# EAGLE schematic AllOfTheAbove (EAGLE 9.5.1)

## Sheet 1 of 3: Jacks and pots
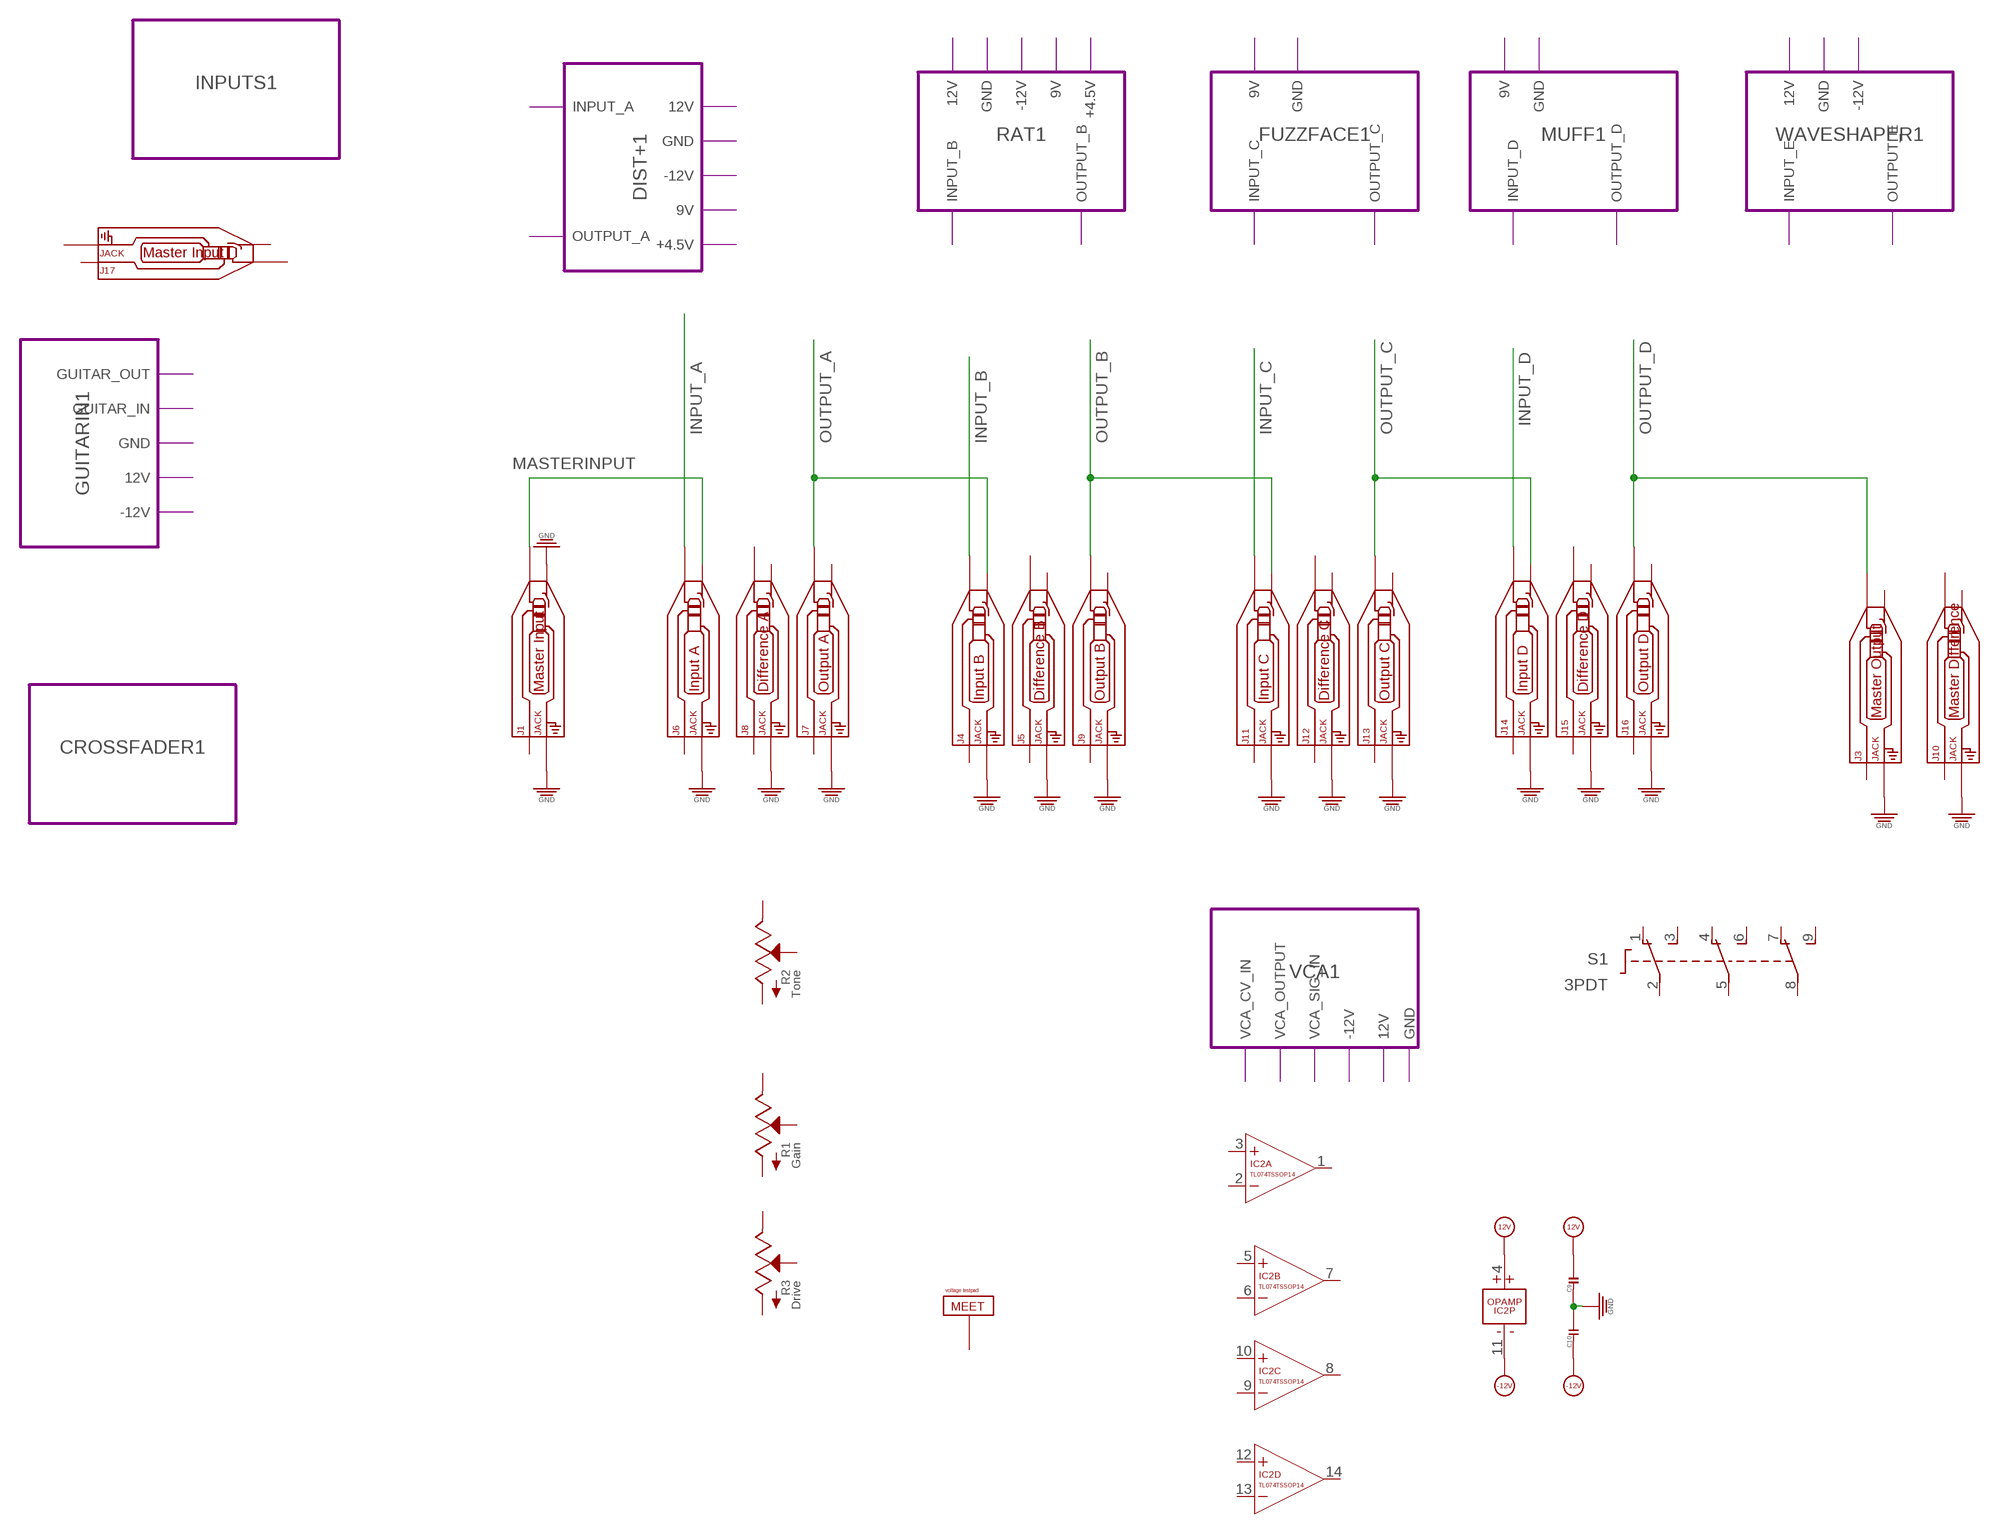
[diagram p0: schematic, sheet 1]

### Parts
C9  C-0603  [C0603]
C10  C-0603  [C0603]
IC2  TL074TSSOP14  [TSSOP14]
J1  JACK  AUDIO-JACK_SMALLSYMBOLNODRILL  [3.5MM-JACK-SWITCH-13MM-NOHOLES]
J3  JACK  AUDIO-JACK_SMALLSYMBOLNODRILL  [3.5MM-JACK-SWITCH-13MM-NOHOLES]
J4  JACK  AUDIO-JACK_SMALLSYMBOLNODRILL  [3.5MM-JACK-SWITCH-13MM-NOHOLES]
J5  JACK  AUDIO-JACK_SMALLSYMBOLNODRILL  [3.5MM-JACK-SWITCH-13MM-NOHOLES]
J6  JACK  AUDIO-JACK_SMALLSYMBOLNODRILL  [3.5MM-JACK-SWITCH-13MM-NOHOLES]
J7  JACK  AUDIO-JACK_SMALLSYMBOLNODRILL  [3.5MM-JACK-SWITCH-13MM-NOHOLES]
J8  JACK  AUDIO-JACK_SMALLSYMBOLNODRILL  [3.5MM-JACK-SWITCH-13MM-NOHOLES]
J9  JACK  AUDIO-JACK_SMALLSYMBOLNODRILL  [3.5MM-JACK-SWITCH-13MM-NOHOLES]
J10  JACK  AUDIO-JACK_SMALLSYMBOLNODRILL  [3.5MM-JACK-SWITCH-13MM-NOHOLES]
J11  JACK  AUDIO-JACK_SMALLSYMBOLNODRILL  [3.5MM-JACK-SWITCH-13MM-NOHOLES]
J12  JACK  AUDIO-JACK_SMALLSYMBOLNODRILL  [3.5MM-JACK-SWITCH-13MM-NOHOLES]
J13  JACK  AUDIO-JACK_SMALLSYMBOLNODRILL  [3.5MM-JACK-SWITCH-13MM-NOHOLES]
J14  JACK  AUDIO-JACK_SMALLSYMBOLNODRILL  [3.5MM-JACK-SWITCH-13MM-NOHOLES]
J15  JACK  AUDIO-JACK_SMALLSYMBOLNODRILL  [3.5MM-JACK-SWITCH-13MM-NOHOLES]
J16  JACK  AUDIO-JACK_SMALLSYMBOLNODRILL  [3.5MM-JACK-SWITCH-13MM-NOHOLES]
J17  JACK  AUDIO-JACK_SMALLSYMBOLNODRILL  [3.5MM-JACK-SWITCH-13MM-NOHOLES]
R1  POTSQUAREHOLE_SMALLKNOB  [ALPS_POT_SQUAREHOLES]
R2  POTSQUAREHOLE_SMALLKNOB  [ALPS_POT_SQUAREHOLES]
R3  POTSQUAREHOLE_SMALLKNOB  [ALPS_POT_SQUAREHOLES]
S1  3PDT  [3PDT]
U$13  VOLTAGETESTPAD  [POWERTESTPAD]

### Module instances
DIST+1 = DIST+
RAT1 = RAT
FUZZFACE1 = FUZZFACE
MUFF1 = MUFF
WAVESHAPER1 = WAVESHAPER
GUITARIN1 = GUITARIN
VCA1 = VCA
INPUTS1 = INPUTS
CROSSFADER1 = CROSSFADER

### Nets
12V: C9.2 IC2.4(P:V+) ; also sheet 2,3
-12V: C10.1 IC2.11(P:V-) ; also sheet 2,3
GND: C9.1 C10.2 J1.RING_B@1(RING) J1.RING_T@3(RING) J1.SWITCH_B@1(SWITCH) J1.SWITCH_T@3(SWITCH) J3.RING_B@1(RING) J3.RING_T@3(RING) J4.RING_B@1(RING) J4.RING_T@3(RING) J5.RING_B@1(RING) J5.RING_T@3(RING) J6.RING_B@1(RING) J6.RING_T@3(RING) J7.RING_B@1(RING) J7.RING_T@3(RING) J8.RING_B@1(RING) J8.RING_T@3(RING) J9.RING_B@1(RING) J9.RING_T@3(RING) J10.RING_B@1(RING) J10.RING_T@3(RING) J11.RING_B@1(RING) J11.RING_T@3(RING) J12.RING_B@1(RING) J12.RING_T@3(RING) J13.RING_B@1(RING) J13.RING_T@3(RING) J14.RING_B@1(RING) J14.RING_T@3(RING) J15.RING_B@1(RING) J15.RING_T@3(RING) J16.RING_B@1(RING) J16.RING_T@3(RING) ; also sheet 2,3
INPUT_A: J6.TIP_B@1(TIP) J6.TIP_T@3(TIP)
INPUT_B: J4.TIP_B@1(TIP) J4.TIP_T@3(TIP)
INPUT_C: J11.TIP_B@1(TIP) J11.TIP_T@3(TIP)
INPUT_D: J14.TIP_B@1(TIP) J14.TIP_T@3(TIP)
MASTERINPUT: J1.TIP_B@1(TIP) J1.TIP_T@3(TIP) J6.SWITCH_B@1(SWITCH) J6.SWITCH_T@3(SWITCH)
OUTPUT_A: J4.SWITCH_B@1(SWITCH) J4.SWITCH_T@3(SWITCH) J7.TIP_B@1(TIP) J7.TIP_T@3(TIP)
OUTPUT_B: J9.TIP_B@1(TIP) J9.TIP_T@3(TIP) J11.SWITCH_B@1(SWITCH) J11.SWITCH_T@3(SWITCH)
OUTPUT_C: J13.TIP_B@1(TIP) J13.TIP_T@3(TIP) J14.SWITCH_B@1(SWITCH) J14.SWITCH_T@3(SWITCH)
OUTPUT_D: J3.TIP_B@1(TIP) J3.TIP_T@3(TIP) J16.TIP_B@1(TIP) J16.TIP_T@3(TIP)
Unconnected: IC2.1(A:OUT) IC2.2(A:-IN) IC2.3(A:+IN) IC2.5(B:+IN) IC2.6(B:-IN) IC2.7(B:OUT) IC2.8(C:OUT) IC2.9(C:-IN) IC2.10(C:+IN) IC2.12(D:+IN) IC2.13(D:-IN) IC2.14(D:OUT) J1.SECOND_B@1(SECOND) J1.SECOND_T@3(SECOND) J3.SECOND_B@1(SECOND) J3.SECOND_T@3(SECOND) J3.SWITCH_B@1(SWITCH) J3.SWITCH_T@3(SWITCH) J4.SECOND_B@1(SECOND) J4.SECOND_T@3(SECOND) J5.SECOND_B@1(SECOND) J5.SECOND_T@3(SECOND) J5.SWITCH_B@1(SWITCH) J5.SWITCH_T@3(SWITCH) J5.TIP_B@1(TIP) J5.TIP_T@3(TIP) J6.SECOND_B@1(SECOND) J6.SECOND_T@3(SECOND) J7.SECOND_B@1(SECOND) J7.SECOND_T@3(SECOND) J7.SWITCH_B@1(SWITCH) J7.SWITCH_T@3(SWITCH) J8.SECOND_B@1(SECOND) J8.SECOND_T@3(SECOND) J8.SWITCH_B@1(SWITCH) J8.SWITCH_T@3(SWITCH) J8.TIP_B@1(TIP) J8.TIP_T@3(TIP) J9.SECOND_B@1(SECOND) J9.SECOND_T@3(SECOND) J9.SWITCH_B@1(SWITCH) J9.SWITCH_T@3(SWITCH) J10.SECOND_B@1(SECOND) J10.SECOND_T@3(SECOND) J10.SWITCH_B@1(SWITCH) J10.SWITCH_T@3(SWITCH) J10.TIP_B@1(TIP) J10.TIP_T@3(TIP) J11.SECOND_B@1(SECOND) J11.SECOND_T@3(SECOND) J12.SECOND_B@1(SECOND) J12.SECOND_T@3(SECOND) J12.SWITCH_B@1(SWITCH) J12.SWITCH_T@3(SWITCH) J12.TIP_B@1(TIP) J12.TIP_T@3(TIP) J13.SECOND_B@1(SECOND) J13.SECOND_T@3(SECOND) J13.SWITCH_B@1(SWITCH) J13.SWITCH_T@3(SWITCH) J14.SECOND_B@1(SECOND) J14.SECOND_T@3(SECOND) J15.SECOND_B@1(SECOND) J15.SECOND_T@3(SECOND) J15.SWITCH_B@1(SWITCH) J15.SWITCH_T@3(SWITCH) J15.TIP_B@1(TIP) J15.TIP_T@3(TIP) J16.SECOND_B@1(SECOND) J16.SECOND_T@3(SECOND) J16.SWITCH_B@1(SWITCH) J16.SWITCH_T@3(SWITCH) J17.RING_B@1(RING) J17.RING_T@3(RING) J17.SECOND_B@1(SECOND) J17.SECOND_T@3(SECOND) J17.SWITCH_B@1(SWITCH) J17.SWITCH_T@3(SWITCH) J17.TIP_B@1(TIP) J17.TIP_T@3(TIP) R1.P$1(E) R1.P$2(S) R1.P$3(A) R2.P$1(E) R2.P$2(S) R2.P$3(A) R3.P$1(E) R3.P$2(S) R3.P$3(A) S1.1(O1) S1.2(P1) S1.3(S1) S1.4(O2) S1.5(P2) S1.6(S2) S1.7(O3) S1.8(P3) S1.9(S3) U$13.P$1(VOLTAGE) U$13.P$2(VOLTAGE) U$13.P$3(VOLTAGE)

## Sheet 2 of 3: Power
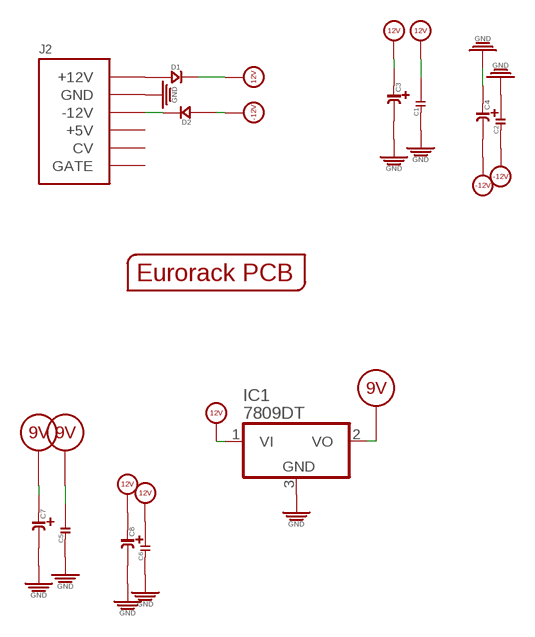
[diagram p1: schematic, sheet 2]

### Parts
C1  C-0603  [C0603]
C2  C-0603  [C0603]
C3  C-POLAR-A  [CASE-A_3216]
C4  C-POLAR-A  [CASE-A_3216]
C5  C-0603  [C0603]
C6  C-0603  [C0603]
C7  C-POLAR-A  [CASE-A_3216]
C8  C-POLAR-A  [CASE-A_3216]
D1  D-SMA  [DO-214AC]
D2  D-SMA  [DO-214AC]
IC1  7809DT  7805DT  [TO252]
J2  POWERSHROUDED  [POWER_16_SHROUDED]
PCB1  EURORACK_PCB36HP_10CM  [EURORACK36HP]

### Nets
9V: C5.2 C7.+ IC1.2(VO)
12V: C1.2 C3.+ C6.2 C8.+ D1.2(-) IC1.1(VI) ; also sheet 1,3
-12V: C2.1 C4.- D2.1(+) ; also sheet 1,3
GND: C1.1 C2.2 C3.- C4.+ C5.1 C6.1 C7.- C8.- IC1.3(GND) J2.3(GND) J2.4(GND) J2.5(GND) J2.6(GND) J2.7(GND) J2.8(GND) ; also sheet 1,3
N$2: D1.1(+) J2.9(+12V) J2.10(+12V)
N$3: D2.2(-) J2.1(-12V) J2.2(-12V)
Unconnected: J2.11(+5V) J2.12(+5V) J2.13(CV) J2.14(CV) J2.15(GATE) J2.16(GATE)

## Sheet 3 of 3
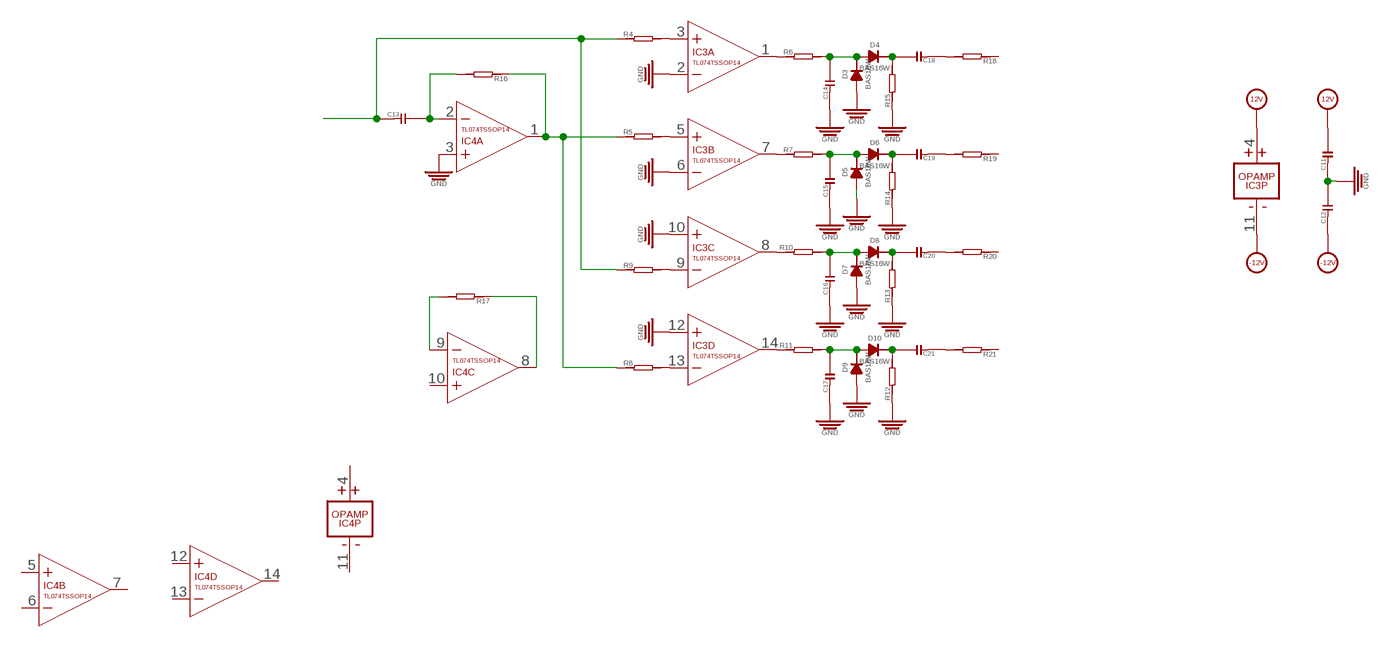
[diagram p2: schematic, sheet 3]

### Parts
C11  C-0603  [C0603]
C12  C-0603  [C0603]
C13  C-0603  [C0603]
C14  C-0603  [C0603]
C15  C-0603  [C0603]
C16  C-0603  [C0603]
C17  C-0603  [C0603]
C18  C-0603  [C0603]
C19  C-0603  [C0603]
C20  C-0603  [C0603]
C21  C-0603  [C0603]
D3  BAS16W  [SOT-323]
D4  BAS16W  [SOT-323]
D5  BAS16W  [SOT-323]
D6  BAS16W  [SOT-323]
D7  BAS16W  [SOT-323]
D8  BAS16W  [SOT-323]
D9  BAS16W  [SOT-323]
D10  BAS16W  [SOT-323]
IC3  TL074TSSOP14  [TSSOP14]
IC4  TL074TSSOP14  [TSSOP14]
R4  R-0603  [R0603]
R5  R-0603  [R0603]
R6  R-0603  [R0603]
R7  R-0603  [R0603]
R8  R-0603  [R0603]
R9  R-0603  [R0603]
R10  R-0603  [R0603]
R11  R-0603  [R0603]
R12  R-0603  [R0603]
R13  R-0603  [R0603]
R14  R-0603  [R0603]
R15  R-0603  [R0603]
R16  R-0603  [R0603]
R17  R-0603  [R0603]
R18  R-0603  [R0603]
R19  R-0603  [R0603]
R20  R-0603  [R0603]
R21  R-0603  [R0603]

### Nets
12V: C11.2 IC3.4(P:V+) ; also sheet 1,2
-12V: C12.1 IC3.11(P:V-) ; also sheet 1,2
GND: C11.1 C12.2 C14.1 C15.1 C16.1 C17.1 D3.ANODE D5.ANODE D7.ANODE D9.ANODE IC3.2(A:-IN) IC3.6(B:-IN) IC3.10(C:+IN) IC3.12(D:+IN) IC4.3(A:+IN) R12.1 R13.1 R14.1 R15.1 ; also sheet 1,2
N$1: IC3.3(A:+IN) R4.2
N$4: IC3.5(B:+IN) R5.2
N$5: IC3.1(A:OUT) R6.1
N$6: IC3.7(B:OUT) R7.1
N$7: IC3.9(C:-IN) R9.2
N$8: IC3.13(D:-IN) R8.2
N$9: IC3.14(D:OUT) R11.1
N$10: IC3.8(C:OUT) R10.1
N$11: IC4.1(A:OUT) R5.1 R8.1 R16.1
N$12: C13.2 IC4.2(A:-IN) R16.2
N$13: IC4.8(C:OUT) R17.1
N$14: IC4.9(C:-IN) R17.2
N$15: C14.2 D3.CATHODE D4.ANODE R6.2
N$16: C13.1 R4.1 R9.1
N$17: C15.2 D5.CATHODE D6.ANODE R7.2
N$18: C16.2 D7.CATHODE D8.ANODE R10.2
N$19: C17.2 D9.CATHODE D10.ANODE R11.2
N$24: C19.2 D6.CATHODE R14.2
N$25: C20.2 D8.CATHODE R13.2
N$26: C21.2 D10.CATHODE R12.2
N$27: C18.2 D4.CATHODE R15.2
N$28: C18.1 R18.2
N$29: C19.1 R19.2
N$30: C20.1 R20.2
N$31: C21.1 R21.2
Unconnected: IC4.5(B:+IN) IC4.6(B:-IN) IC4.7(B:OUT) IC4.10(C:+IN) IC4.12(D:+IN) IC4.13(D:-IN) IC4.14(D:OUT) R18.1 R19.1 R20.1 R21.1

## Power pins joined to a net without a drawn wire
V+: IC4.4(P:V+)
V-: IC4.11(P:V-)

## Library data of the parts
C1 C2 C5 C6 C9-C21 = OPL:C*
C3 C4 C7 C8 = EurorackModularParts:C-POLAR*
D1 D2 = OPL:D*: DIODE
D3-D10 = FenixBase:BAS16W
IC1 = adafruit:78*: Positive VOLTAGE REGULATOR Added bigger pads to the TO-92 package
IC2-IC4 = EurorackModularParts:TL074: OP AMP
J1 J17 = EurorackModularParts:AUDIO-JACK_SMALLSYMBOL: Switching Mono 3.5mm Audio Jack from Erthenvar.; DESC: Master Input
J2 = EurorackModularParts:POWER
J3 = EurorackModularParts:AUDIO-JACK_SMALLSYMBOL: Switching Mono 3.5mm Audio Jack from Erthenvar.; DESC: Master Output
J4 = EurorackModularParts:AUDIO-JACK_SMALLSYMBOL: Switching Mono 3.5mm Audio Jack from Erthenvar.; DESC: Input B
J5 = EurorackModularParts:AUDIO-JACK_SMALLSYMBOL: Switching Mono 3.5mm Audio Jack from Erthenvar.; DESC: Difference B
J6 = EurorackModularParts:AUDIO-JACK_SMALLSYMBOL: Switching Mono 3.5mm Audio Jack from Erthenvar.; DESC: Input A
J7 = EurorackModularParts:AUDIO-JACK_SMALLSYMBOL: Switching Mono 3.5mm Audio Jack from Erthenvar.; DESC: Output A
J8 = EurorackModularParts:AUDIO-JACK_SMALLSYMBOL: Switching Mono 3.5mm Audio Jack from Erthenvar.; DESC: Difference A
J9 = EurorackModularParts:AUDIO-JACK_SMALLSYMBOL: Switching Mono 3.5mm Audio Jack from Erthenvar.; DESC: Output B
J10 = EurorackModularParts:AUDIO-JACK_SMALLSYMBOL: Switching Mono 3.5mm Audio Jack from Erthenvar.; DESC: Master Difference
J11 = EurorackModularParts:AUDIO-JACK_SMALLSYMBOL: Switching Mono 3.5mm Audio Jack from Erthenvar.; DESC: Input C
J12 = EurorackModularParts:AUDIO-JACK_SMALLSYMBOL: Switching Mono 3.5mm Audio Jack from Erthenvar.; DESC: Difference C
J13 = EurorackModularParts:AUDIO-JACK_SMALLSYMBOL: Switching Mono 3.5mm Audio Jack from Erthenvar.; DESC: Output C
J14 = EurorackModularParts:AUDIO-JACK_SMALLSYMBOL: Switching Mono 3.5mm Audio Jack from Erthenvar.; DESC: Input D
J15 = EurorackModularParts:AUDIO-JACK_SMALLSYMBOL: Switching Mono 3.5mm Audio Jack from Erthenvar.; DESC: Difference D
J16 = EurorackModularParts:AUDIO-JACK_SMALLSYMBOL: Switching Mono 3.5mm Audio Jack from Erthenvar.; DESC: Output D
PCB1 = EurorackModularParts:EURORACK_PCB
R1 = EurorackModularParts:POT; DESC: Gain
R2 = EurorackModularParts:POT; DESC: Tone
R3 = EurorackModularParts:POT; DESC: Drive
R4-R21 = OPL:R*
S1 = switch:3PDT: 3PDT 9 pin footswitch SF17020F-0302-21R-L Source: 3PDT.jpg
U$13 = FenixBase:VOLTAGETESTPAD; DESC: MEET

## Module DIST+
Ports: INPUT_A(io) OUTPUT_A(io) 12V(io) GND(io) -12V(io) 9V(io) +4.5V(io)
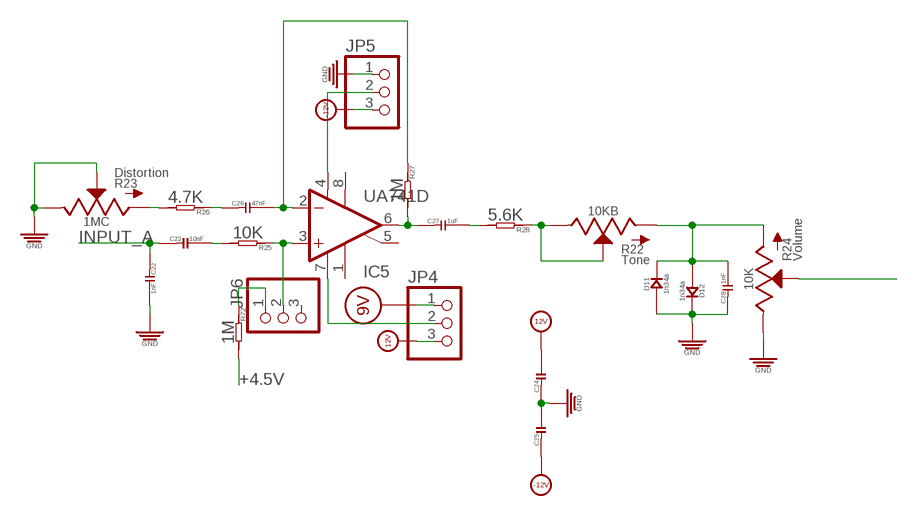
[diagram p3: schematic, module DIST+, sheet 1]

### Parts
C22  1nF  C-0603  [C0603]
C23  10nF  C-0603  [C0603]
C24  C-0603  [C0603]
C25  C-0603  [C0603]
C26  47nF  C-0603  [C0603]
C27  1uF  C-0603  [C0603]
C28  1nF  C-0603  [C0603]
D11  1n34a  D-D1206  [LL-34]
D12  1n34a  D-D1206  [LL-34]
IC5  UA741D  [SO08]
JP4  PINHD-1X3  [1X03]
JP5  PINHD-1X3  [1X03]
JP6  PINHD-1X3  [1X03]
R22  10KB  POTSQUAREHOLE_SMALLKNOB  [ALPS_POT_SQUAREHOLES]
R23  1MC  POTSQUAREHOLE_SMALLKNOB  [ALPS_POT_SQUAREHOLES]
R24  10K  POTSQUAREHOLE_SMALLKNOB  [ALPS_POT_SQUAREHOLES]
R25  10K  R-0603  [R0603]
R26  4.7K  R-0603  [R0603]
R27  1M  R-0603  [R0603]
R28  5.6K  R-0603  [R0603]
R72  1M  R-0603  [R0603]

### Nets
9V: JP4.1
12V: C24.2 JP4.3
+4.5V: R72.2
-12V: C25.1 JP5.3
GND: C22.2 C24.1 C25.2 C28.1 D11.A(+) D12.C(-) JP5.1 R23.P$1(E) R23.P$2(S) R24.P$1(E)
INPUT_A: C22.1 C23.1
N$20: C23.2 R25.2
N$21: IC5.3(+IN) JP6.2 R25.1
N$22: C26.2 IC5.2(-IN) R27.1
N$23: C26.1 R26.1
N$32: C27.1 IC5.6(OUT) R27.2
N$33: R23.P$3(A) R26.2
N$34: C28.2 D11.C(-) D12.A(+) R22.P$3(A) R24.P$3(A)
N$35: C27.2 R28.2
N$36: R22.P$1(E) R22.P$2(S) R28.1
N$81: IC5.7(V+) JP4.2
N$82: IC5.4(V-) JP5.2
N$87: JP6.1 R72.1
OUTPUT_A: R24.P$2(S)
Unconnected: IC5.1(ON1) IC5.5(ON2) IC5.8(OPT) JP6.3

### Library data of the parts
C22-C28 = OPL:C*
D11 D12 = OPL:D*: DIODE
IC5 = linear:*741: OP AMP
JP4-JP6 = pinhead:PINHD-1X3: PIN HEADER
R22 = EurorackModularParts:POT; DESC: Tone
R23 = EurorackModularParts:POT; DESC: Distortion
R24 = EurorackModularParts:POT; DESC: Volume
R25-R28 R72 = OPL:R*

## Module RAT
Ports: INPUT_B(io) OUTPUT_B(io) 12V(io) GND(io) -12V(io) 9V(io) +4.5V(io)
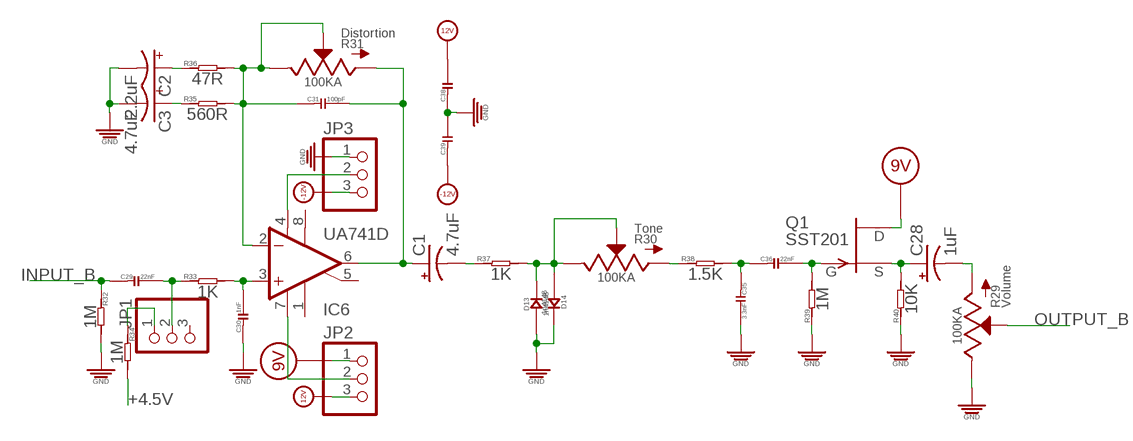
[diagram p4: schematic, module RAT, sheet 1]

### Parts
C1  4.7uF  CPOL-US153CLV-0505  [153CLV-0505]
C2  2.2uF  CPOL-US153CLV-0505  [153CLV-0505]
C3  4.7uF  CPOL-US153CLV-0505  [153CLV-0505]
C28  1uF  CPOL-US153CLV-0505  [153CLV-0505]
C29  22nF  C-0603  [C0603]
C30  1nF  C-0603  [C0603]
C31  100pF  C-0603  [C0603]
C35  3.3nF  C-0603  [C0603]
C36  22nF  C-0603  [C0603]
C38  C-0603  [C0603]
C39  C-0603  [C0603]
D13  1n4148  D-D1206  [LL-34]
D14  1n4148  D-D1206  [LL-34]
IC6  UA741D  [SO08]
JP1  PINHD-1X3  [1X03]
JP2  PINHD-1X3  [1X03]
JP3  PINHD-1X3  [1X03]
Q1  SST201  [SOT23]
R29  100KA  POTSQUAREHOLE_SMALLKNOB  [ALPS_POT_SQUAREHOLES]
R30  100KA  POTSQUAREHOLE_SMALLKNOB  [ALPS_POT_SQUAREHOLES]
R31  100KA  POTSQUAREHOLE_SMALLKNOB  [ALPS_POT_SQUAREHOLES]
R32  1M  R-0603  [R0603]
R33  1K  R-0603  [R0603]
R34  1M  R-0603  [R0603]
R35  560R  R-0603  [R0603]
R36  47R  R-0603  [R0603]
R37  1K  R-0603  [R0603]
R38  1.5K  R-0603  [R0603]
R39  1M  R-0603  [R0603]
R40  10K  R-0603  [R0603]

### Nets
9V: JP2.1 Q1.1(D)
12V: C38.2 JP2.3
+4.5V: R34.2
-12V: C39.1 JP3.3
GND: C2.- C3.- C30.1 C35.2 C38.1 C39.2 D13.A(+) D14.C(-) JP3.1 R29.P$1(E) R32.2 R39.1 R40.1
INPUT_B: C29.1 R32.1
N$37: C29.2 JP1.2 R33.1
N$38: C30.2 IC6.3(+IN) R33.2
N$39: IC6.7(V+) JP2.2
N$40: IC6.4(V-) JP3.2
N$41: JP1.1 R34.1
N$42: C31.1 IC6.2(-IN) R31.P$1(E) R31.P$2(S) R35.2 R36.2
N$43: C1.+ C31.2 IC6.6(OUT) R31.P$3(A)
N$44: C1.- R37.1
N$45: D13.C(-) D14.A(+) R30.P$1(E) R30.P$2(S) R37.2
N$46: R30.P$3(A) R38.1
N$47: C2.+ R36.1
N$48: C3.+ R35.1
N$49: C35.1 C36.1 R38.2
N$50: C36.2 Q1.3(G) R39.2
N$51: C28.+ Q1.2(S) R40.2
N$52: C28.- R29.P$3(A)
OUTPUT_B: R29.P$2(S)
Unconnected: IC6.1(ON1) IC6.5(ON2) IC6.8(OPT) JP1.3

### Library data of the parts
C1-C3 C28 = adafruit:CPOL-US: POLARIZED CAPACITOR, American symbol
C29-C31 C35 C36 C38 C39 = OPL:C*
D13 D14 = OPL:D*: DIODE
IC6 = linear:*741: OP AMP
JP1-JP3 = pinhead:PINHD-1X3: PIN HEADER
Q1 = transistor-fet:?20*: TEMIC / Siliconix N-Channel JFET Source: JFET-J201_Siliconix_data.pdf
R29 = EurorackModularParts:POT; DESC: Volume
R30 = EurorackModularParts:POT; DESC: Tone
R31 = EurorackModularParts:POT; DESC: Distortion
R32-R40 = OPL:R*

## Module FUZZFACE
Ports: INPUT_C(io) OUTPUT_C(io) 9V(io) GND(io)
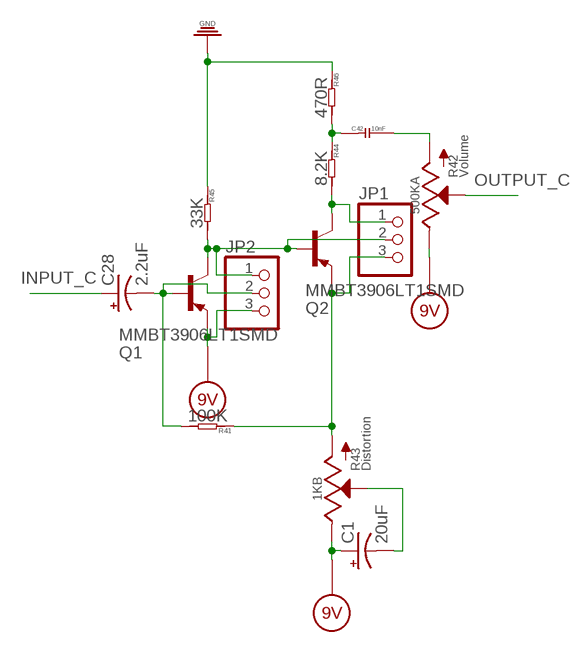
[diagram p5: schematic, module FUZZFACE, sheet 1]

### Parts
C1  20uF  CPOL-US153CLV-0505  [153CLV-0505]
C28  2.2uF  CPOL-US153CLV-0505  [153CLV-0505]
C42  10nF  C-0603  [C0603]
JP1  PINHD-1X3  [1X03]
JP2  PINHD-1X3  [1X03]
Q1  MMBT3906LT1SMD  [SOT23-BEC]
Q2  MMBT3906LT1SMD  [SOT23-BEC]
R41  100K  R-0603  [R0603]
R42  500KA  POTSQUAREHOLE_SMALLKNOB  [ALPS_POT_SQUAREHOLES]
R43  1KB  POTSQUAREHOLE_SMALLKNOB  [ALPS_POT_SQUAREHOLES]
R44  8.2K  R-0603  [R0603]
R45  33K  R-0603  [R0603]
R46  470R  R-0603  [R0603]

### Nets
9V: C1.+ JP2.3 Q1.E R42.P$1(E) R43.P$1(E)
GND: R45.1 R46.1
INPUT_C: C28.+
N$53: JP1.3 Q2.E R41.1 R43.P$3(A)
N$54: C28.- JP2.2 Q1.B R41.2
N$55: JP1.2 JP2.1 Q1.C Q2.B R45.2
N$56: C1.- R43.P$2(S)
N$57: C42.2 R42.P$3(A)
N$58: C42.1 R44.1 R46.2
N$59: JP1.1 Q2.C R44.2
OUTPUT_C: R42.P$2(S)

### Library data of the parts
C1 C28 = adafruit:CPOL-US: POLARIZED CAPACITOR, American symbol
C42 = OPL:C*
JP1 JP2 = pinhead:PINHD-1X3: PIN HEADER
Q1 Q2 = transistor-pnp:MMBT3906*: PNP Transistror
R41 R44-R46 = OPL:R*
R42 = EurorackModularParts:POT; DESC: Volume
R43 = EurorackModularParts:POT; DESC: Distortion

## Module MUFF
Ports: INPUT_D(io) OUTPUT_D(io) 9V(io) GND(io)
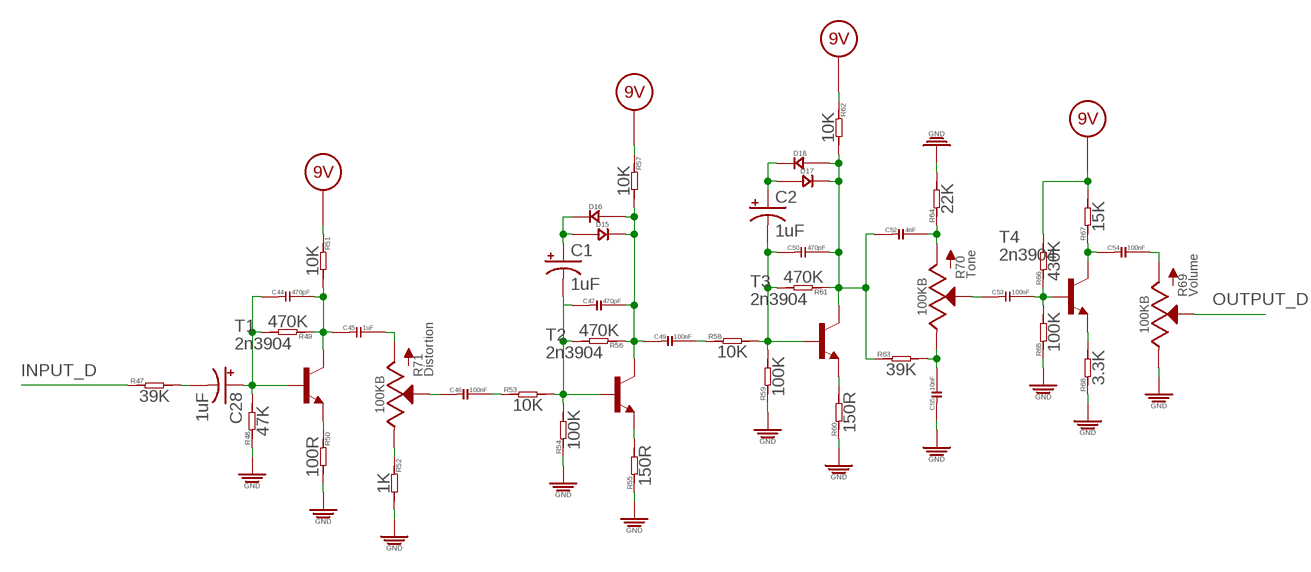
[diagram p6: schematic, module MUFF, sheet 1]

### Parts
C1  1uF  CPOL-US153CLV-0505  [153CLV-0505]
C2  1uF  CPOL-US153CLV-0505  [153CLV-0505]
C28  1uF  CPOL-US153CLV-0505  [153CLV-0505]
C44  470pF  C-0603  [C0603]
C45  1uF  C-0603  [C0603]
C46  100nF  C-0603  [C0603]
C47  470pF  C-0603  [C0603]
C49  100nF  C-0603  [C0603]
C50  470pF  C-0603  [C0603]
C52  4nF  C-0603  [C0603]
C53  100nF  C-0603  [C0603]
C54  100nF  C-0603  [C0603]
C55  10nF  C-0603  [C0603]
D15  D-D1206  [LL-34]
D16  D-D1206  [LL-34]
D17  D-D1206  [LL-34]
D18  D-D1206  [LL-34]
R47  39K  R-0603  [R0603]
R48  47K  R-0603  [R0603]
R49  470K  R-0603  [R0603]
R50  100R  R-0603  [R0603]
R51  10K  R-0603  [R0603]
R52  1K  R-0603  [R0603]
R53  10K  R-0603  [R0603]
R54  100K  R-0603  [R0603]
R55  150R  R-0603  [R0603]
R56  470K  R-0603  [R0603]
R57  10K  R-0603  [R0603]
R58  10K  R-0603  [R0603]
R59  100K  R-0603  [R0603]
R60  150R  R-0603  [R0603]
R61  470K  R-0603  [R0603]
R62  10K  R-0603  [R0603]
R63  39K  R-0603  [R0603]
R64  22K  R-0603  [R0603]
R65  100K  R-0603  [R0603]
R66  430K  R-0603  [R0603]
R67  15K  R-0603  [R0603]
R68  3.3K  R-0603  [R0603]
R69  100KB  POTSQUAREHOLE_SMALLKNOB  [ALPS_POT_SQUAREHOLES]
R70  100KB  POTSQUAREHOLE_SMALLKNOB  [ALPS_POT_SQUAREHOLES]
R71  100KB  POTSQUAREHOLE_SMALLKNOB  [ALPS_POT_SQUAREHOLES]
T1  2n3904  MMBT3904LT1-NPN-SOT23-BEC  [SOT23-BEC]
T2  2n3904  MMBT3904LT1-NPN-SOT23-BEC  [SOT23-BEC]
T3  2n3904  MMBT3904LT1-NPN-SOT23-BEC  [SOT23-BEC]
T4  2n3904  MMBT3904LT1-NPN-SOT23-BEC  [SOT23-BEC]

### Nets
9V: R51.1 R57.1 R62.1 R66.2 R67.2
GND: C55.1 R48.1 R50.2 R52.2 R54.1 R55.1 R59.1 R60.1 R64.2 R65.1 R68.1 R69.P$1(E)
INPUT_D: R47.1
N$1: C28.- R47.2
N$61: C28.+ C44.1 R48.2 R49.2 T1.B
N$62: R50.1 T1.E
N$63: C44.2 C45.1 R49.1 R51.2 T1.C
N$64: C45.2 R71.P$3(A)
N$65: C1.- C47.1 R53.2 R54.2 R56.2 T2.B
N$66: C1.+ D15.A(+) D16.C(-)
N$67: R55.2 T2.E
N$68: C47.2 C49.1 D15.C(-) D16.A(+) R56.1 R57.2 T2.C
N$69: C49.2 R58.1
N$70: C2.- C50.1 R58.2 R59.2 R61.2 T3.B
N$71: R60.2 T3.E
N$72: C50.2 C52.1 D17.C(-) D18.A(+) R61.1 R62.2 R63.1 T3.C
N$73: C53.1 R70.P$2(S)
N$74: C55.2 R63.2 R70.P$1(E)
N$75: C52.2 R64.1 R70.P$3(A)
N$76: C2.+ D17.A(+) D18.C(-)
N$77: C53.2 R65.2 R66.1 T4.B
N$78: C54.1 R67.1 T4.C
N$79: R68.2 T4.E
N$80: C54.2 R69.P$3(A)
N$84: R52.1 R71.P$1(E)
N$85: C46.2 R53.1
N$86: C46.1 R71.P$2(S)
OUTPUT_D: R69.P$2(S)

### Library data of the parts
C1 C2 C28 = adafruit:CPOL-US: POLARIZED CAPACITOR, American symbol
C44-C47 C49 C50 C52-C55 = OPL:C*
D15-D18 = OPL:D*: DIODE
R47-R68 = OPL:R*
R69 = EurorackModularParts:POT; DESC: Volume
R70 = EurorackModularParts:POT; DESC: Tone
R71 = EurorackModularParts:POT; DESC: Distortion
T1-T4 = transistor-neu-to92:*-NPN-: NPN Transistror

## Module WAVESHAPER
Ports: INPUT_E(io) OUTPUT_E(io) 12V(io) GND(io) -12V(io)
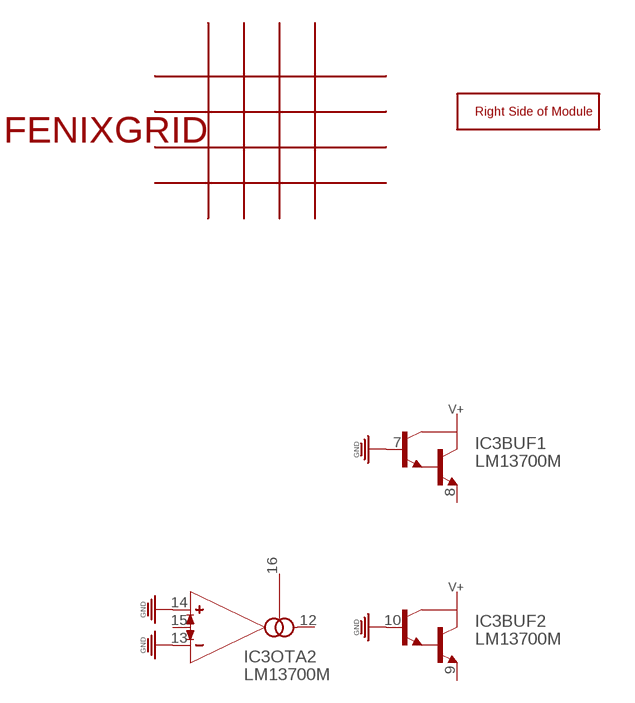
[diagram p7: schematic, module WAVESHAPER, sheet 1, part 1 of 3]
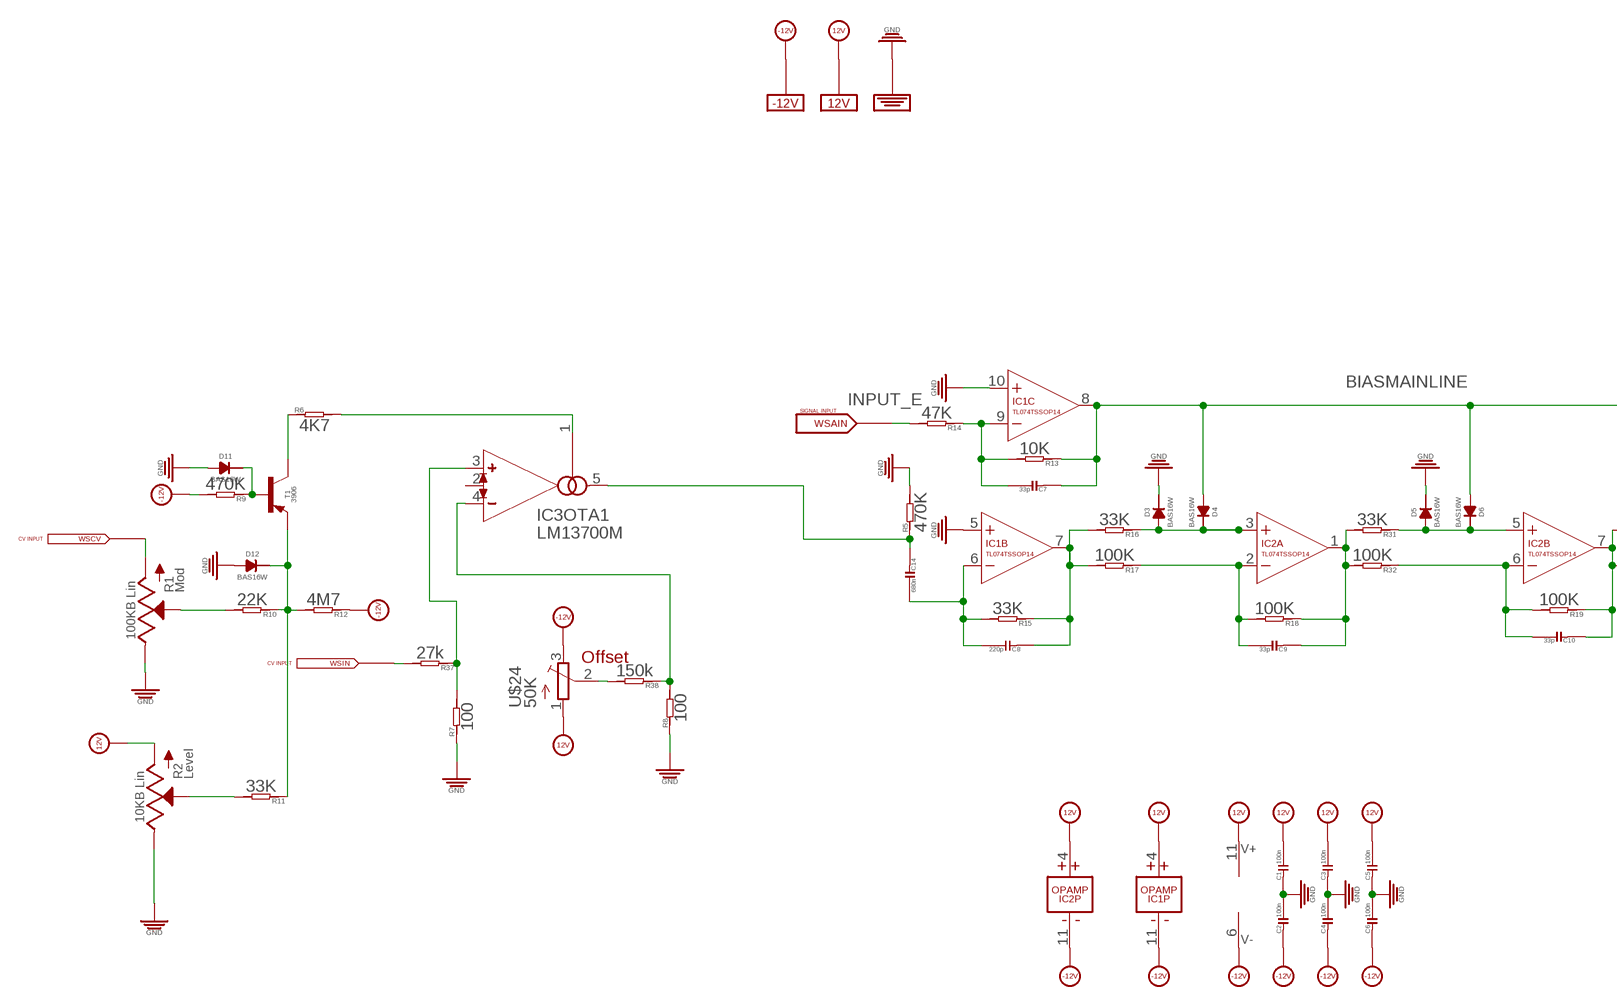
[diagram p8: schematic, module WAVESHAPER, sheet 1, part 2 of 3]
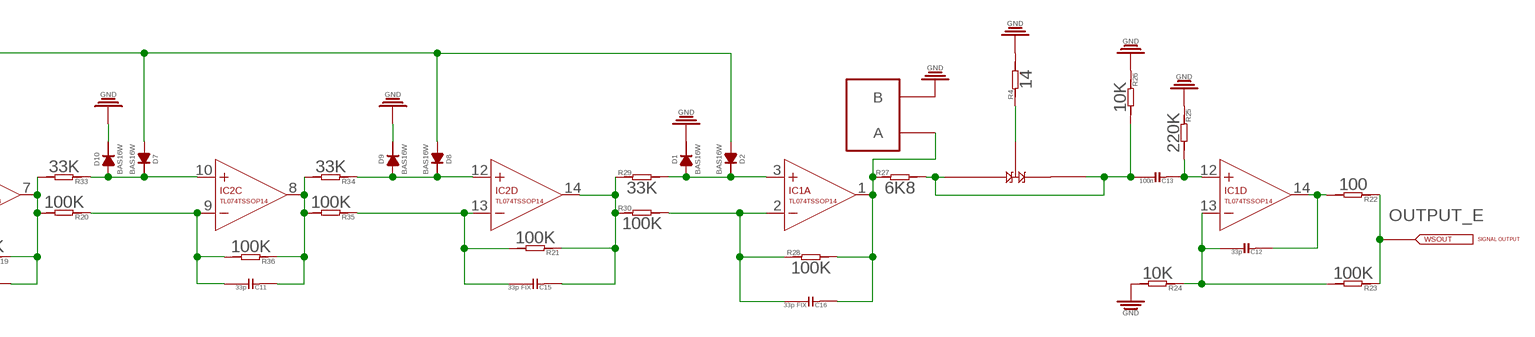
[diagram p9: schematic, module WAVESHAPER, sheet 1, part 3 of 3]

### Parts
12V  POWER12V  [FENIXINTERNALCONNECTIONPAD]
-12V  POWER-12V  [FENIXINTERNALCONNECTIONPAD]
C1  100n  C-0603  [C0603]
C2  100n  C-0603  [C0603]
C3  100n  C-0603  [C0603]
C4  100n  C-0603  [C0603]
C5  100n  C-0603  [C0603]
C6  100n  C-0603  [C0603]
C7  33p  C-0603  [C0603]
C8  220p  C-0603  [C0603]
C9  33p  C-0603  [C0603]
C10  33p  C-0603  [C0603]
C11  33p  C-0603  [C0603]
C12  33p  C-0603  [C0603]
C13  100n  C-0603  [C0603]
C14  680n  C-0603  [C0603]
C15  33p FIX  C-0603  [C0603]
C16  33p FIX  C-0603  [C0603]
D1  BAS16W  [SOT-323]
D2  BAS16W  [SOT-323]
D3  BAS16W  [SOT-323]
D4  BAS16W  [SOT-323]
D5  BAS16W  [SOT-323]
D6  BAS16W  [SOT-323]
D7  BAS16W  [SOT-323]
D8  BAS16W  [SOT-323]
D9  BAS16W  [SOT-323]
D10  BAS16W  [SOT-323]
D11  BAS16W  [SOT-323]
D12  BAS16W  [SOT-323]
GND  POWERGND  [FENIXINTERNALCONNECTIONPAD]
IC1  TL074TSSOP14  [TSSOP14]
IC2  TL074TSSOP14  [TSSOP14]
IC3  LM13700M  [SO16]
R1  100KB Lin  POTSQUAREHOLE_SMALLKNOB  [ALPS_POT_SQUAREHOLES]
R2  10KB Lin  POTSQUAREHOLE_SMALLKNOB  [ALPS_POT_SQUAREHOLES]
R4  14  R-0603  [R0603]
R5  470K  R-0603  [R0603]
R6  4K7  R-0603  [R0603]
R7  100  R-0603  [R0603]
R8  100  R-0603  [R0603]
R9  470K  R-0603  [R0603]
R10  22K  R-0603  [R0603]
R11  33K  R-0603  [R0603]
R12  4M7  R-0603  [R0603]
R13  10K  R-0603  [R0603]
R14  47K  R-0603  [R0603]
R15  33K  R-0603  [R0603]
R16  33K  R-0603  [R0603]
R17  100K  R-0603  [R0603]
R18  100K  R-0603  [R0603]
R19  100K  R-0603  [R0603]
R20  100K  R-0603  [R0603]
R21  100K  R-0603  [R0603]
R22  100  R-0603  [R0603]
R23  100K  R-0603  [R0603]
R24  10K  R-0603  [R0603]
R25  220K  R-0603  [R0603]
R26  10K  R-0603  [R0603]
R27  6K8  R-0603  [R0603]
R28  100K  R-0603  [R0603]
R29  33K  R-0603  [R0603]
R30  100K  R-0603  [R0603]
R31  33K  R-0603  [R0603]
R32  100K  R-0603  [R0603]
R33  33K  R-0603  [R0603]
R34  33K  R-0603  [R0603]
R35  100K  R-0603  [R0603]
R36  100K  R-0603  [R0603]
R37  27k  R-0603  [R0603]
R38  150k  R-0603  [R0603]
T1  3906  MMBT3906LT1-PNP-SOT23-BEC  [SOT23-BEC]
U$1  MODULEEND  [MODULEEND]
U$2  FENIXGRID  [FENIXGRID]
U$3  TESTPOINT_DUAL_PTH  [TESTPAD_DUAL_PTH]
U$11  BAT54S  [SOT23]
U$24  50K  TRIMPOTTC33X  [TC33X]
WSAIN  SIGNALIN  [FENIXINTERNALCONNECTIONPAD]
WSCV  CVIN  [FENIXINTERNALCONNECTIONPAD]
WSIN  CVIN  [FENIXINTERNALCONNECTIONPAD]
WSOUT  SIGNALOUT  [FENIXINTERNALCONNECTIONPAD]

### Nets
12V [power]: 12V.P$1(12V) C1.2 C3.2 C5.2 IC1.4(P:V+) IC2.4(P:V+) IC3.11(SUPPLY:V+) R2.P$3(A) U$24.1(A)
-12V [power]: -12V.P$1(-12V) C2.1 C4.1 C6.1 IC1.11(P:V-) IC2.11(P:V-) IC3.6(SUPPLY:V-) R9.2 R12.1 U$24.3(E)
BIASMAINLINE: C7.1 D2.ANODE D4.ANODE D6.ANODE D7.ANODE D8.ANODE IC1.8(C:OUT) R13.1
GND [power]: C1.1 C2.2 C3.1 C4.2 C5.1 C6.2 D1.CATHODE D3.CATHODE D5.CATHODE D9.CATHODE D10.CATHODE D11.ANODE D12.ANODE GND.P$1(GND) IC1.5(B:+IN) IC1.10(C:+IN) IC3.7(BUF1:B) IC3.10(BUF2:B) IC3.13(OTA2:IN_N) IC3.14(OTA2:IN_P) R1.P$1(E) R2.P$1(E) R4.2 R5.2 R7.1 R8.1 R24.2 R25.1 R26.1 U$3.P$2(B)
INPUT_E: R14.2 WSAIN.P$1
N$1: R4.1 U$11.P$3
N$3: C7.2 IC1.9(C:-IN) R13.2 R14.1
N$5: R1.P$2(S) R10.2
N$6: R1.P$3(A) WSCV.P$1
N$7: D12.CATHODE R10.1 R11.1 R12.2 T1.E
N$8: R2.P$2(S) R11.2
N$9: C13.2 R26.2 R27.2 U$11.P$1 U$11.P$2
N$10: R6.1 T1.C
N$11: C8.1 IC1.7(B:OUT) R15.1 R16.2 R17.2
N$12: C8.2 C14.2 IC1.6(B:-IN) R15.2
N$13: C14.1 IC3.5(OTA1:OUT) R5.1
N$14: D3.ANODE D4.CATHODE IC2.3(A:+IN) R16.1
N$15: C9.1 IC2.1(A:OUT) R18.1 R31.2 R32.2
N$16: D5.ANODE D6.CATHODE IC2.5(B:+IN) R31.1
N$17: C9.2 IC2.2(A:-IN) R17.1 R18.2
N$18: C11.2 IC2.9(C:-IN) R20.1 R36.2
N$19: C16.1 IC1.1(A:OUT) R27.1 R28.2 U$3.P$1(A)
N$20: D8.CATHODE D9.ANODE IC2.12(D:+IN) R34.1
N$21: C10.2 IC2.6(B:-IN) R19.2 R32.1
N$22: C10.1 IC2.7(B:OUT) R19.1 R20.2 R33.2
N$23: D7.CATHODE D10.ANODE IC2.10(C:+IN) R33.1
N$24: C11.1 IC2.8(C:OUT) R34.2 R35.2 R36.1
N$25: C13.1 IC1.12(D:+IN) R25.2
N$26: C15.2 IC2.13(D:-IN) R21.2 R35.1
N$27: C15.1 IC2.14(D:OUT) R21.1 R29.1 R30.1
N$28: D1.ANODE D2.CATHODE IC1.3(A:+IN) R29.2
N$29: C12.1 IC1.14(D:OUT) R22.2
N$30: C16.2 IC1.2(A:-IN) R28.1 R30.2
N$32: C12.2 IC1.13(D:-IN) R23.2 R24.1
N$33: D11.CATHODE R9.1 T1.B
N$34: IC3.1(OTA1:I_BIAS) R6.2
N$35: R37.2 WSIN.P$1
N$36: IC3.3(OTA1:IN_P) R7.2 R37.1
N$37: R38.2 U$24.2(S)
N$38: IC3.4(OTA1:IN_N) R8.2 R38.1
OUTPUT_E: R22.1 R23.1 WSOUT.P$1
Unconnected: IC3.2(OTA1:I_DIODE) IC3.8(BUF1:E) IC3.9(BUF2:E) IC3.12(OTA2:OUT) IC3.15(OTA2:I_DIODE) IC3.16(OTA2:I_BIAS)

### Library data of the parts
12V = FenixBase:POWER12V
-12V = FenixBase:POWER-12V
C1-C16 = OPL:C*
D1-D12 = FenixBase:BAS16W
GND = FenixBase:POWERGND
IC1 IC2 = EurorackModularParts:TL074: OP AMP
IC3 = ota:LM13700: Dual OTA with buffers
R1 = EurorackModularParts:POT; DESC: Mod
R2 = EurorackModularParts:POT; DESC: Level
R4-R38 = OPL:R*
T1 = transistor:*-PNP-: PNP Transistror
U$1 = FenixBase:MODULEEND
U$2 = FenixBase:FENIXGRID; DESC: Waveshaper
U$3 = FenixBase:TESTPOINT_DUAL
U$11 = FenixBase:BAT54S
U$24 = adafruit:TRIMPOT: SMT trimmer potentiometer part number TC33X http://www.ladyada.net/library/eagle; DESC: Offset
WSAIN = FenixBase:SIGNALIN
WSCV WSIN = FenixBase:CVIN
WSOUT = FenixBase:SIGNALOUT

## Module GUITARIN
Ports: -12V(io) 12V(io) GND(io) GUITAR_IN(io) GUITAR_OUT(io)
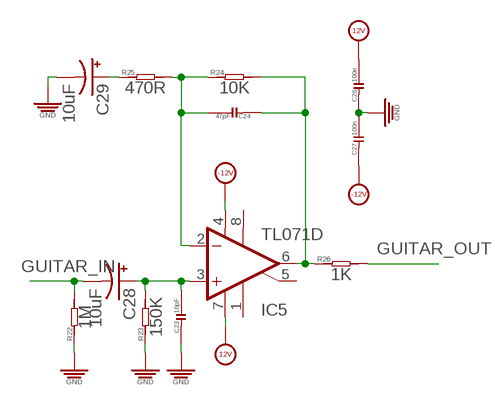
[diagram p10: schematic, module GUITARIN, sheet 1]

### Parts
C23  10pF  C-0603  [C0603]
C24  47pF  C-0603  [C0603]
C26  100n  C-0603  [C0603]
C27  100n  C-0603  [C0603]
C28  10uF  CPOL-US153CLV-0505  [153CLV-0505]
C29  10uF  CPOL-US153CLV-0505  [153CLV-0505]
IC5  TL071D  [SO08]
R22  1M  R-0603  [R0603]
R23  150K  R-0603  [R0603]
R24  10K  R-0603  [R0603]
R25  470R  R-0603  [R0603]
R26  1K  R-0603  [R0603]

### Nets
12V: C26.2 IC5.7(V+)
-12V: C27.1 IC5.4(V-)
GND: C23.1 C26.1 C27.2 C29.- R22.1 R23.1
GUITAR_IN: C28.- R22.2
GUITAR_OUT: R26.2
N$20: C23.2 C28.+ IC5.3(+IN) R23.2
N$21: C29.+ R25.1
N$22: C24.1 IC5.6(OUT) R24.2 R26.1
N$23: C24.2 IC5.2(-IN) R24.1 R25.2
Unconnected: IC5.1(ON1) IC5.5(ON2) IC5.8(OPT)

### Library data of the parts
C23 C24 C26 C27 = OPL:C*
C28 C29 = adafruit:CPOL-US: POLARIZED CAPACITOR, American symbol
IC5 = EurorackModularParts:TL071: OP AMP
R22-R26 = OPL:R*

## Module VCA
Ports: VCA_CV_IN(io) VCA_OUTPUT(io) VCA_SIG_IN(io) -12V(io) 12V(io) GND(io)
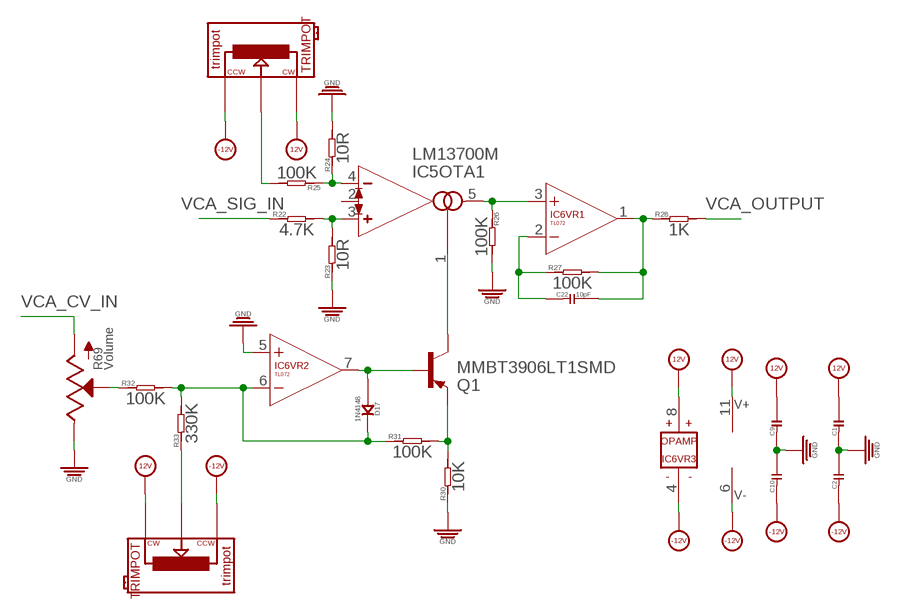
[diagram p11: schematic, module VCA, sheet 1]

### Parts
C1  C-0603  [C0603]
C2  C-0603  [C0603]
C9  C-0603  [C0603]
C10  C-0603  [C0603]
C22  10pF  C-0603  [C0603]
D17  1N4148  D-D1206  [LL-34]
IC5  LM13700M  [SO16]
IC6  TL072  [SO08]
Q1  MMBT3906LT1SMD  [SOT23-BEC]
R22  4.7K  R-0603  [R0603]
R23  10R  R-0603  [R0603]
R24  10R  R-0603  [R0603]
R25  100K  R-0603  [R0603]
R26  100K  R-0603  [R0603]
R27  100K  R-0603  [R0603]
R28  1K  R-0603  [R0603]
R29  TRIMPOT  [TRIMPOT]
R30  10K  R-0603  [R0603]
R31  100K  R-0603  [R0603]
R32  100K  R-0603  [R0603]
R33  330K  R-0603  [R0603]
R34  TRIMPOT  [TRIMPOT]
R69  POTSQUAREHOLE_SMALLKNOB  [ALPS_POT_SQUAREHOLES]

### Nets
12V: C1.2 C9.2 IC5.11(SUPPLY:V+) IC6.8(VR3:V+) R29.P$3 R34.P$3
-12V: C2.1 C10.1 IC5.6(SUPPLY:V-) IC6.4(VR3:V-) R29.P$1 R34.P$1
GND: C1.1 C2.2 C9.1 C10.2 IC6.5(VR2:+IN) R23.1 R24.2 R26.2 R30.1 R69.P$1(E)
N$20: IC5.4(OTA1:IN_N) R24.1 R25.1
N$21: IC5.3(OTA1:IN_P) R22.2 R23.2
N$22: IC5.5(OTA1:OUT) IC6.3(VR1:+IN) R26.1
N$23: C22.1 IC6.2(VR1:-IN) R27.1
N$32: R25.2 R29.P$2
N$33: C22.2 IC6.1(VR1:OUT) R27.2 R28.1
N$36: D17.A(+) IC6.7(VR2:OUT) Q1.B
N$37: D17.C(-) IC6.6(VR2:-IN) R31.1 R32.2 R33.2
N$38: Q1.E R30.2 R31.2
N$39: IC5.1(OTA1:I_BIAS) Q1.C
N$40: R33.1 R34.P$2
N$42: R32.1 R69.P$2(S)
VCA_CV_IN: R69.P$3(A)
VCA_OUTPUT: R28.2
VCA_SIG_IN: R22.1
Unconnected: IC5.2(OTA1:I_DIODE) IC5.7(BUF1:B) IC5.8(BUF1:E) IC5.9(BUF2:E) IC5.10(BUF2:B) IC5.12(OTA2:OUT) IC5.13(OTA2:IN_N) IC5.14(OTA2:IN_P) IC5.15(OTA2:I_DIODE) IC5.16(OTA2:I_BIAS)

### Library data of the parts
C1 C2 C9 C10 C22 = OPL:C*
D17 = OPL:D*: DIODE
IC5 = ota:LM13700: Dual OTA with buffers
IC6 = EurorackModularParts:TL072
Q1 = transistor-pnp:MMBT3906*: PNP Transistror
R22-R28 R30-R33 = OPL:R*
R29 R34 = EurorackModularParts:TRIMPOT
R69 = EurorackModularParts:POT; DESC: Volume

## Module INPUTS
Ports: 
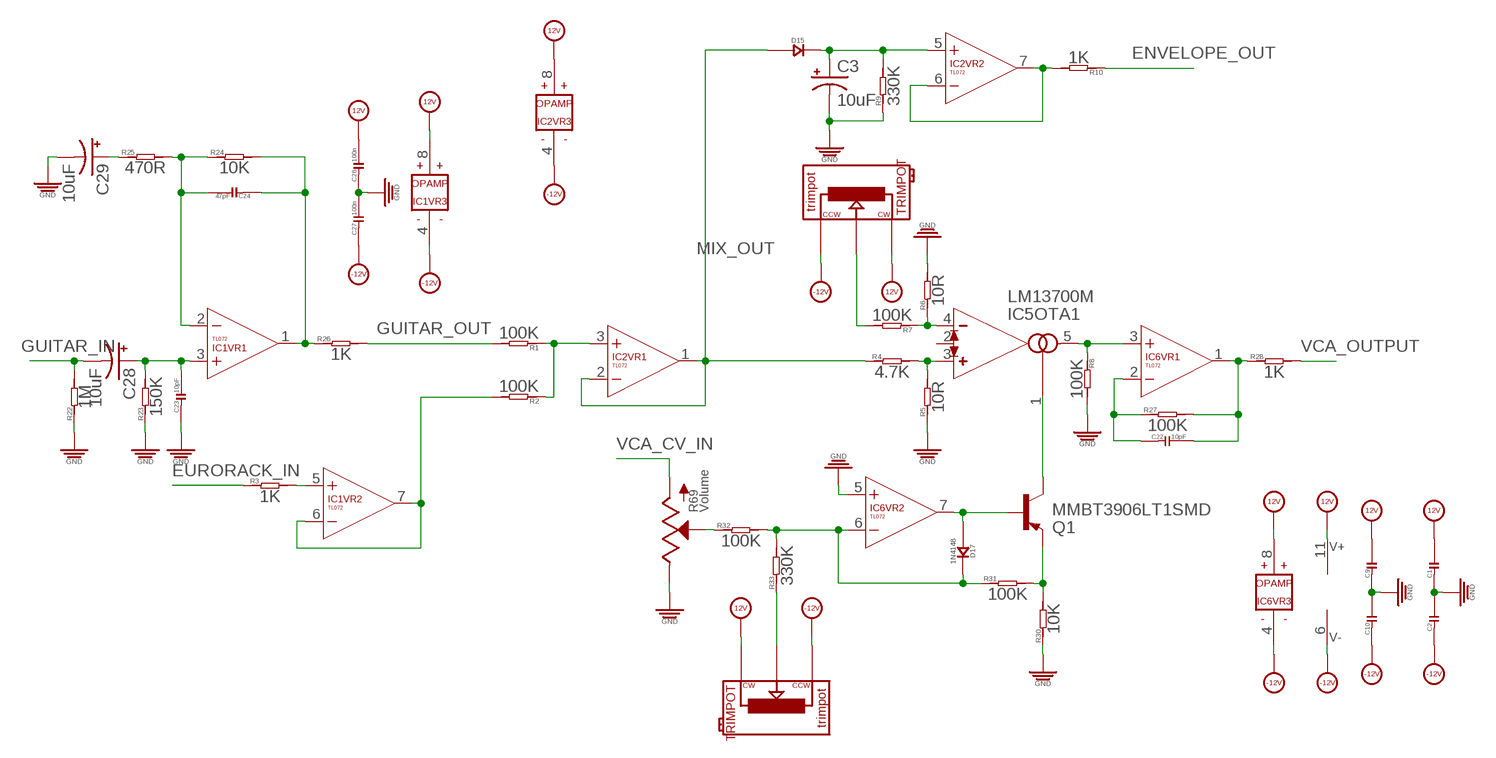
[diagram p12: schematic, module INPUTS, sheet 1]

### Parts
C1  C-0603  [C0603]
C2  C-0603  [C0603]
C3  10uF  CPOL-US153CLV-0505  [153CLV-0505]
C9  C-0603  [C0603]
C10  C-0603  [C0603]
C22  10pF  C-0603  [C0603]
C23  10pF  C-0603  [C0603]
C24  47pF  C-0603  [C0603]
C26  100n  C-0603  [C0603]
C27  100n  C-0603  [C0603]
C28  10uF  CPOL-US153CLV-0505  [153CLV-0505]
C29  10uF  CPOL-US153CLV-0505  [153CLV-0505]
D15  D-D1206  [LL-34]
D17  1N4148  D-D1206  [LL-34]
IC1  TL072  [SO08]
IC2  TL072  [SO08]
IC5  LM13700M  [SO16]
IC6  TL072  [SO08]
Q1  MMBT3906LT1SMD  [SOT23-BEC]
R1  100K  R-0603  [R0603]
R2  100K  R-0603  [R0603]
R3  1K  R-0603  [R0603]
R4  4.7K  R-0603  [R0603]
R5  10R  R-0603  [R0603]
R6  10R  R-0603  [R0603]
R7  100K  R-0603  [R0603]
R8  100K  R-0603  [R0603]
R9  330K  R-0603  [R0603]
R10  1K  R-0603  [R0603]
R22  1M  R-0603  [R0603]
R23  150K  R-0603  [R0603]
R24  10K  R-0603  [R0603]
R25  470R  R-0603  [R0603]
R26  1K  R-0603  [R0603]
R27  100K  R-0603  [R0603]
R28  1K  R-0603  [R0603]
R29  TRIMPOT  [TRIMPOT]
R30  10K  R-0603  [R0603]
R31  100K  R-0603  [R0603]
R32  100K  R-0603  [R0603]
R33  330K  R-0603  [R0603]
R34  TRIMPOT  [TRIMPOT]
R69  POTSQUAREHOLE_SMALLKNOB  [ALPS_POT_SQUAREHOLES]

### Nets
12V: C1.2 C9.2 C26.2 IC1.8(VR3:V+) IC2.8(VR3:V+) IC5.11(SUPPLY:V+) IC6.8(VR3:V+) R29.P$3 R34.P$3
-12V: C2.1 C10.1 C27.1 IC1.4(VR3:V-) IC2.4(VR3:V-) IC5.6(SUPPLY:V-) IC6.4(VR3:V-) R29.P$1 R34.P$1
ENVELOPE_OUT: R10.1
EURORACK_IN: R3.1
GND: C1.1 C2.2 C3.- C9.1 C10.2 C23.1 C26.1 C27.2 C29.- IC6.5(VR2:+IN) R5.1 R6.2 R8.2 R9.1 R22.1 R23.1 R30.1 R69.P$1(E)
GUITAR_IN: C28.- R22.2
GUITAR_OUT: R1.2 R26.2
MIX_OUT: D15.A(+) IC2.1(VR1:OUT) IC2.2(VR1:-IN) R4.1
N$1: IC1.6(VR2:-IN) IC1.7(VR2:OUT) R2.2
N$2: IC1.5(VR2:+IN) R3.2
N$3: IC2.6(VR2:-IN) IC2.7(VR2:OUT) R10.2
N$4: IC5.4(OTA1:IN_N) R6.1 R7.1
N$5: IC5.3(OTA1:IN_P) R4.2 R5.2
N$6: IC5.5(OTA1:OUT) IC6.3(VR1:+IN) R8.1
N$7: C22.1 IC6.2(VR1:-IN) R27.1
N$8: C3.+ D15.C(-) IC2.5(VR2:+IN) R9.2
N$20: C23.2 C28.+ IC1.3(VR1:+IN) R23.2
N$21: C29.+ R25.1
N$22: C24.1 IC1.1(VR1:OUT) R24.2 R26.1
N$23: C24.2 IC1.2(VR1:-IN) R24.1 R25.2
N$32: R7.2 R29.P$2
N$33: C22.2 IC6.1(VR1:OUT) R27.2 R28.1
N$36: D17.A(+) IC6.7(VR2:OUT) Q1.B
N$37: D17.C(-) IC6.6(VR2:-IN) R31.1 R32.2 R33.2
N$38: Q1.E R30.2 R31.2
N$39: IC5.1(OTA1:I_BIAS) Q1.C
N$40: R33.1 R34.P$2
N$42: R32.1 R69.P$2(S)
VCA_CV_IN: R69.P$3(A)
VCA_OUTPUT: R28.2
VCA_SIG_IN: IC2.3(VR1:+IN) R1.1 R2.1
Unconnected: IC5.2(OTA1:I_DIODE) IC5.7(BUF1:B) IC5.8(BUF1:E) IC5.9(BUF2:E) IC5.10(BUF2:B) IC5.12(OTA2:OUT) IC5.13(OTA2:IN_N) IC5.14(OTA2:IN_P) IC5.15(OTA2:I_DIODE) IC5.16(OTA2:I_BIAS)

### Library data of the parts
C1 C2 C9 C10 C22-C24 C26 C27 = OPL:C*
C3 C28 C29 = adafruit:CPOL-US: POLARIZED CAPACITOR, American symbol
D15 D17 = OPL:D*: DIODE
IC1 IC2 IC6 = EurorackModularParts:TL072
IC5 = ota:LM13700: Dual OTA with buffers
Q1 = transistor-pnp:MMBT3906*: PNP Transistror
R1-R10 R22-R28 R30-R33 = OPL:R*
R29 R34 = EurorackModularParts:TRIMPOT
R69 = EurorackModularParts:POT; DESC: Volume

## Module CROSSFADER
Ports: 
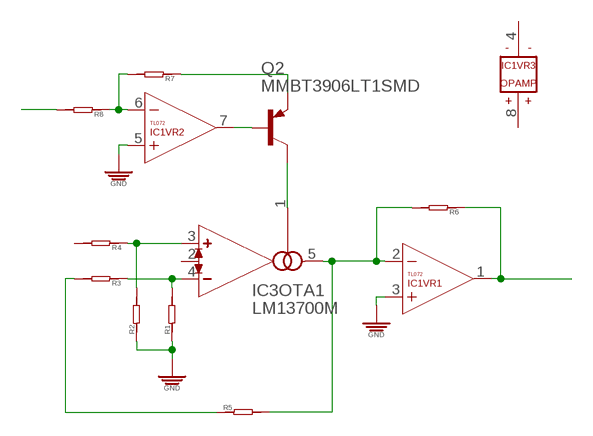
[diagram p13: schematic, module CROSSFADER, sheet 1]

### Parts
IC1  TL072  [SO08]
IC3  LM13700M  [SO16]
Q2  MMBT3906LT1SMD  [SOT23-BEC]
R1  R-0603  [R0603]
R2  R-0603  [R0603]
R3  R-0603  [R0603]
R4  R-0603  [R0603]
R5  R-0603  [R0603]
R6  R-0603  [R0603]
R7  R-0603  [R0603]
R8  R-0603  [R0603]

### Nets
GND: IC1.3(VR1:+IN) IC1.5(VR2:+IN) R1.1 R2.1
N$1: IC3.4(OTA1:IN_N) R1.2 R3.1
N$2: IC3.3(OTA1:IN_P) R2.2 R4.1
N$3: R3.2 R5.1
N$4: IC1.2(VR1:-IN) IC3.5(OTA1:OUT) R5.2 R6.2
N$5: IC1.1(VR1:OUT) R6.1
N$6: IC3.1(OTA1:I_BIAS) Q2.C
N$7: IC1.7(VR2:OUT) Q2.B
N$8: IC1.6(VR2:-IN) R7.2 R8.1
N$9: R8.2
N$10: Q2.E R7.1
Unconnected: IC3.2(OTA1:I_DIODE) IC3.6(SUPPLY:V-) IC3.7(BUF1:B) IC3.8(BUF1:E) IC3.9(BUF2:E) IC3.10(BUF2:B) IC3.11(SUPPLY:V+) IC3.12(OTA2:OUT) IC3.13(OTA2:IN_N) IC3.14(OTA2:IN_P) IC3.15(OTA2:I_DIODE) IC3.16(OTA2:I_BIAS) R4.2

### Power pins joined to a net without a drawn wire
V+: IC1.8(VR3:V+)
V-: IC1.4(VR3:V-)

### Library data of the parts
IC1 = EurorackModularParts:TL072
IC3 = ota:LM13700: Dual OTA with buffers
Q2 = transistor-pnp:MMBT3906*: PNP Transistror
R1-R8 = OPL:R*

## Net classes
1 power: width 0.381 mm